# Altium schematic sheet solenoid_drv.SchDoc: Solenoid Control
size A4; Organization: Badgerloop Electrical; Address1: 133 Engineering Research Building; Address2: 1500 Engineering Drive; Address3: Madison, Wi 53706
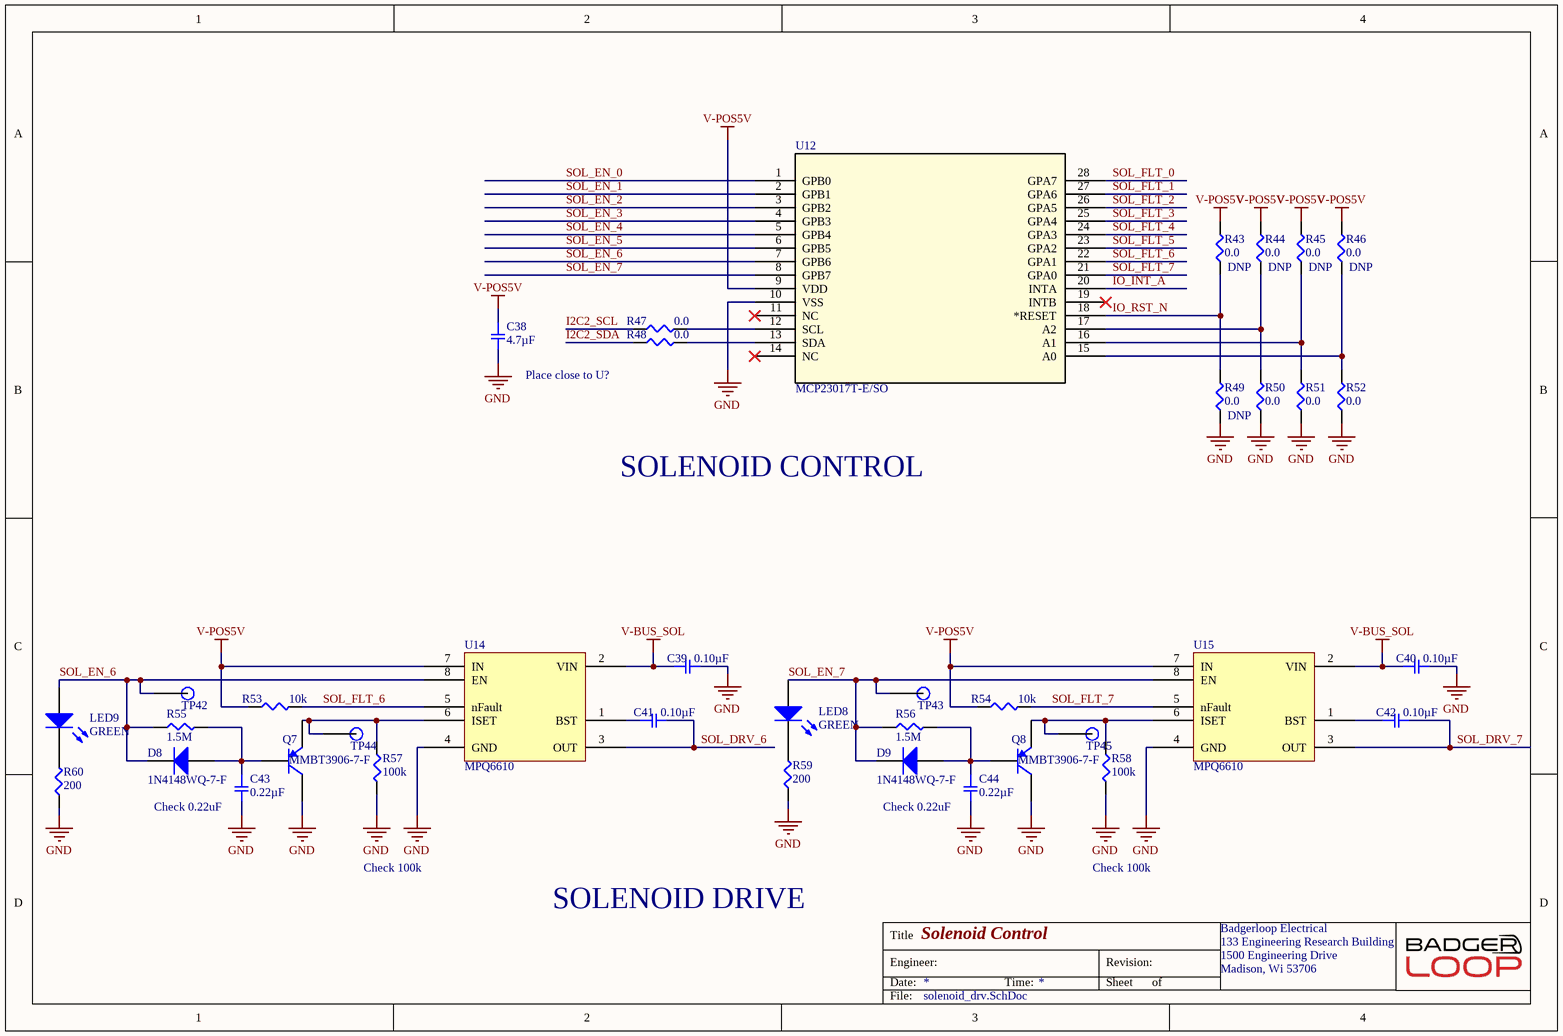
[diagram p0: solenoid_drv.SchDoc]

## Parts
C38  4.7µF  [SMD-0805C]
C39  0.10µF  [SMD-0805C]
C40  0.10µF  [SMD-0805C]
C41  0.10µF  [SMD-0805C]
C42  0.10µF  [SMD-0805C]
C43  0.22µF  [SMD-0805C]
C44  0.22µF  [SMD-0805C]
D8  1N4148WQ-7-F  [INDM3838X18N]
D9  1N4148WQ-7-F  [INDM3838X18N]
LED8  GREEN  [LED 0603 GREEN]
LED9  GREEN  [LED 0603 GREEN]
Q7  MMBT3906-7-F  [SOTFL103P240X110-3N]
Q8  MMBT3906-7-F  [SOTFL103P240X110-3N]
R43  0.0  [SMD-0805-RES]
R44  0.0  [SMD-0805-RES]
R45  0.0  [SMD-0805-RES]
R46  0.0  [SMD-0805-RES]
R47  0.0  [SMD-0805-RES]
R48  0.0  [SMD-0805-RES]
R49  0.0  [SMD-0805-RES]
R50  0.0  [SMD-0805-RES]
R51  0.0  [SMD-0805-RES]
R52  0.0  [SMD-0805-RES]
R53  10k  [SMD-0805-RES]
R54  10k  [SMD-0805-RES]
R55  1.5M  [SMD-0805-RES]
R56  1.5M  [SMD-0805-RES]
R57  100k  [SMD-0805-RES]
R58  100k  [SMD-0805-RES]
R59  200  [SMD-0805-RES]
R60  200  [SMD-0805-RES]
TP42  TP  [Test Point]  (value not drawn)
TP43  TP  [Test Point]  (value not drawn)
TP44  TP  [Test Point]  (value not drawn)
TP45  TP  [Test Point]  (value not drawn)
U12  MCP23017T-E/SO  [SOIC28-W_MC-M]
U14  MPQ6610  [SOP127P600X175-8N]
U15  MPQ6610  [SOP127P600X175-8N]

## Nets
GND: C38.2 C39.2 C40.2 C43.2 C44.2 Q7.3(C) Q8.3(C) R49.1 R50.1 R51.1 R52.1 R57.2 R58.2 R59.1 R60.1 U12.10(VSS) U14.4(GND) U15.4(GND)
V-BUS_SOL: C39.1 C40.1 U14.2(VIN) U15.2(VIN)
V-POS5V: C38.1 R43.2 R44.2 R45.2 R46.2 R53.1 R54.1 U12.9(VDD) U14.7(IN) U15.7(IN)
I2C2_SCL: R47.1
I2C2_SDA: R48.1
IO_INT_A: U12.20(INTA)
IO_RST_N: R43.1 R49.2 U12.18(*RESET)
SOL_DRV_6: C41.2 U14.3(OUT)
SOL_DRV_7: C42.2 U15.3(OUT)
SOL_EN_0: U12.1(GPB0)
SOL_EN_1: U12.2(GPB1)
SOL_EN_2: U12.3(GPB2)
SOL_EN_3: U12.4(GPB3)
SOL_EN_4: U12.5(GPB4)
SOL_EN_5: U12.6(GPB5)
SOL_EN_6: D8.2(K) LED9.1(A) R55.1 TP42.1 U12.7(GPB6) U14.8(EN)
SOL_EN_7: D9.2(K) LED8.1(A) R56.1 TP43.1 U12.8(GPB7) U15.8(EN)
SOL_FLT_0: U12.28(GPA7)
SOL_FLT_1: U12.27(GPA6)
SOL_FLT_2: U12.26(GPA5)
SOL_FLT_3: U12.25(GPA4)
SOL_FLT_4: U12.24(GPA3)
SOL_FLT_5: U12.23(GPA2)
SOL_FLT_6: R53.2 U12.22(GPA1) U14.5(nFault)
SOL_FLT_7: R54.2 U12.21(GPA0) U15.5(nFault)
NetC41_1: C41.1 U14.1(BST)
NetC42_1: C42.1 U15.1(BST)
NetC43_1: C43.1 D8.1(A) Q7.1(B) R55.2
NetC44_1: C44.1 D9.1(A) Q8.1(B) R56.2
NetLED8_2: LED8.2(K) R59.2
NetLED9_2: LED9.2(K) R60.2
NetQ7_2: Q7.2(E) R57.1 TP44.1 U14.6(ISET)
NetQ8_2: Q8.2(E) R58.1 TP45.1 U15.6(ISET)
NetR44_1: R44.1 R50.2 U12.17(A2)
NetR45_1: R45.1 R51.2 U12.16(A1)
NetR46_1: R46.1 R52.2 U12.15(A0)
NetR47_2: R47.2 U12.12(SCL)
NetR48_2: R48.2 U12.13(SDA)

Not connected (* = marked no-connect by the designer): U12 11(NC)* 14(NC)* 19(INTB)*

## Notes on the sheet
- Place close to U?
- SOLENOID CONTROL
- (near C43) Check 0.22uF
- (near C44) Check 0.22uF
- Check 100k
- SOLENOID DRIVE
- Title
- Engineer:
- Date:
- Time:
- Revision:
- Sheet
- of
- File:

## Library data of the parts
C38 = GRM21BR60J475KA11L: CAP CER 4.7UF 6.3V X5R 0805; Manufacturer: Murata Electronics North America; Factory Stock: 0; Unit Price (USD): 0.28; Minimum Quantity: 1; Tolerance: ±10%; Datasheets: http://www.murata.com/~/media/webrenewal/support/library/catalog/products/capacitor/mlcc/c02e.pdf; Image: //media.digikey.com/Renders/Murata%20Renders/0805%20(2012%20Metric)%20.85mm.jpg; Digi-Key Part Number: 490-9749-1-ND; Part Number: GRM21BR60J475KA11L; Quantity Available: 2821; @ qty: 0; Packaging: Cut Tape (CT); Series: GRM; Part Status: Active; Value: 4.7µF; Voltage: 6.3V; Temperature Coefficient: X5R; Operating Temperature: -55°C ~ 85°C; Features: -; Ratings: -; Applications: General Purpose; Mounting Type: Surface Mount, MLCC; Package / Case: 0805 (2012 Metric); Size / Dimension: 0.079" L x 0.049" W (2.00mm x 1.25mm); Height - Seated (Max): -; Thickness (Max): 0.055" (1.40mm); Lead Spacing: -; Lead Style: -
C39-C42 = GRM21B7U1A104JA01L: CAP CER 0.1UF 10V U2J 0805; Manufacturer: Murata Electronics North America; Factory Stock: 0; Unit Price (USD): 0.4; Minimum Quantity: 1; Tolerance: ±5%; Datasheets: http://www.murata.com/~/media/webrenewal/support/library/catalog/products/capacitor/mlcc/c02e.pdf; Image: //media.digikey.com/Renders/Murata%20Renders/0805%20(2012%20Metric)%20.85mm.jpg; Digi-Key Part Number: 490-11592-1-ND; Part Number: GRM21B7U1A104JA01L; Quantity Available: 3390; @ qty: 0; Packaging: Cut Tape (CT); Series: GRM; Part Status: Active; Value: 0.10µF; Voltage: 10V; Temperature Coefficient: U2J; Operating Temperature: -55°C ~ 125°C; Features: -; Ratings: -; Applications: General Purpose; Mounting Type: Surface Mount, MLCC; Package / Case: 0805 (2012 Metric); Size / Dimension: 0.079" L x 0.049" W (2.00mm x 1.25mm); Height - Seated (Max): -; Thickness (Max): 0.053" (1.35mm); Lead Spacing: -; Lead Style: -
C43 C44 = LLA215R71A224MA14L: CAP CER 0.22UF 10V X7R 0805; Manufacturer: Murata Electronics North America; Factory Stock: 0; Unit Price (USD): 0.36; Minimum Quantity: 1; Tolerance: ±20%; Datasheets: http://www.murata.com/~/media/webrenewal/support/library/catalog/products/capacitor/mlcc/c02e.pdf; Image: //media.digikey.com/Renders/Murata%20Renders/0805-LLA.jpg; Digi-Key Part Number: 490-4432-1-ND; Part Number: LLA215R71A224MA14L; Quantity Available: 9914; @ qty: 0; Packaging: Cut Tape (CT); Series: LLA; Part Status: Active; Value: 0.22µF; Voltage: 10V; Temperature Coefficient: X7R; Operating Temperature: -55°C ~ 125°C; Features: Low ESL (Multi-Terminal); Ratings: -; Applications: Bypass, Decoupling; Mounting Type: Surface Mount, MLCC; Package / Case: 0805 (2012 Metric); Size / Dimension: 0.079" L x 0.049" W (2.00mm x 1.25mm); Height - Seated (Max): -; Thickness (Max): 0.022" (0.55mm); Lead Spacing: -; Lead Style: -
D8 D9 = 1N4148WQ-7-F: Diodes - General Purpose, Power, Switching SMT Fast Switching Diode; Manufacturer: Diodes Inc.; Digikey Link: https://www.digikey.com/product-detail/en/diodes-incorporated/1N4148WQ-7-F/1N4148WQ-7-FDITR-ND/8136126; Manufacturer P/N: 1N4148WQ-7-F; Digikey P/N: 1N4148WQ-7-FDITR-ND
LED8 LED9 = LED GREEN 0603: Manufacturer: Lite-On Inc.; Manufacturer P/N: LTST-C190KGKT; Digikey P/N: 160-1435-1-ND; Package / Case: 0603; Color: GREEN
Q7 Q8 = MMBT3906-7-F: Manufacturer: Diodes Zetex; Collector Emitter Voltage (VCEO): 40V; Max Power Dissipation: 300mW; Polarity: PNP; Max Collector Current: 200mA; hFE Min: 100; Number of Elements: 1; Frequency: 250MHz; Emitter Base Voltage (VEBO): 6V; Collector Emitter Saturation Voltage: -400mV; Element Configuration: Single; Continuous Collector Current: -200mA; Voltage Rating (DC): -40V; Supplier 1: Digi-Key; Manufacturer Part Number: MMBT3906-7-F; Stock 1: 687580; Pricing 1: 1=0.12000, 10=0.11400, 100=0.06190, 500=0.03806, 1000=0.02596 (USD); RoHS: Yes; Mount: Surface Mount; Case/Package: SOT-23; Number of Pins: 3; Weight: 0.000282oz; Contact Plating: Tin,Matte; Min Operating Temperature: -55°C; Max Operating Temperature: 150°C; Packaging: Tape and Reel; Package Quantity: 3000; Transition Frequency: 250MHz; Collector Emitter Breakdown Voltage: 40V; Max Breakdown Voltage: 40V; Collector Base Voltage (VCBO): 40V; Power Dissipation: 300mW; Max Frequency: 250MHz; Gain Bandwidth Product: 250MHz; Current Rating: -200mA; Length: 3.05mm; Height: 1mm; Width: 1.4mm; Radiation Hardening: No; REACH SVHC: No SVHC; Lead Free: Lead Free; ComponentLink1URL: https://datasheet.ciiva.com/27052/1540746-27052408.pdf?src-supplier=Jameco; ComponentLink1Description: https://datasheet.ciiva.com/27052/1540746-27052408.pdf?src-supplier=Jameco; ComponentLink2URL: https://datasheet.ciiva.com/15139/getdatasheetpartid-255292-15139821.pdf?src-supplier=Verical; ComponentLink2Description: https://datasheet.ciiva.com/15139/getdatasheetpartid-255292-15139821.pdf?src-supplier=Verical
R43-R52 = ERJ-6GEY0R00V: RES SMD 0.0 OHM JUMPER 1/8W 0805; Manufacturer: Panasonic Electronic Components; Factory Stock: 0; Unit Price (USD): 0.00544; @ qty: 1500; Minimum Quantity: 1; Power (Watts): 0.125W, 1/8W; Part Number: ERJ-6GEY0R00V; Datasheets: http://industrial.panasonic.com/www-cgi/jvcr13pz.cgi?E+PZ+3+AOA0001+ERJ6GEY0R00V+7+WW; Image: //media.digikey.com/Renders/Panasonic%20Renders/ERJ-0805%20Pkg.jpg; Digi-Key Part Number: P0.0ACT-ND; Quantity Available: 1597627; Packaging: Cut Tape (CT); Series: ERJ; Part Status: Active; Value: 0.0; Tolerance: Jumper; Composition: Thick Film; Features: Automotive AEC-Q200; Temperature Coefficient: -; Operating Temperature: -55°C ~ 155°C; Package / Case: 0805 (2012 Metric); Supplier Device Package: 0805; Size / Dimension: 0.079" L x 0.049" W (2.00mm x 1.25mm); Height - Seated (Max): 0.028" (0.70mm); Number of Terminations: 2; Failure Rate: -
  R43-R46 R49: DNP: DNP
R53 R54 = ERJ-P06J103V: RES SMD 10K OHM 5% 1/2W 0805; Manufacturer: Panasonic Electronic Components; Factory Stock: 0; Unit Price (USD): 0.01839; @ qty: 1500; Minimum Quantity: 1; Power (Watts): 0.5W, 1/2W; Temperature Coefficient: ±200ppm/°C; Part Number: ERJ-P06J103V; Datasheets: https://industrial.panasonic.com/cdbs/www-data/pdf/RDA0000/AOA0000C243.pdf; Image: //media.digikey.com/Renders/Panasonic%20Renders/ERJ-0805%20Pkg.jpg; Digi-Key Part Number: P10KADCT-ND; Quantity Available: 413576; Packaging: Cut Tape (CT); Series: ERJ; Part Status: Active; Value: 10k; Tolerance: ±5%; Composition: Thick Film; Features: Automotive AEC-Q200, Pulse Withstanding; Operating Temperature: -55°C ~ 155°C; Package / Case: 0805 (2012 Metric); Supplier Device Package: 0805; Size / Dimension: 0.079" L x 0.049" W (2.00mm x 1.25mm); Height - Seated (Max): 0.028" (0.70mm); Number of Terminations: 2; Failure Rate: -
R55 R56 = ERJ-6GEYJ155V: RES SMD 1.5M OHM 5% 1/8W 0805; Manufacturer: Panasonic Electronic Components; Factory Stock: 0; Unit Price (USD): 0.00496; @ qty: 1500; Minimum Quantity: 1; Power (Watts): 0.125W, 1/8W; Temperature Coefficient: -400/ +150ppm/°C; Part Number: ERJ-6GEYJ155V; Datasheets: http://industrial.panasonic.com/www-cgi/jvcr13pz.cgi?E+PZ+3+AOA0001+ERJ6GEYJ155V+7+WW; Image: //media.digikey.com/Renders/Panasonic%20Renders/ERJ-0805%20Pkg.jpg; Digi-Key Part Number: P1.5MACT-ND; Quantity Available: 51728; Packaging: Cut Tape (CT); Series: ERJ; Part Status: Active; Value: 1.5M; Tolerance: ±5%; Composition: Thick Film; Features: Automotive AEC-Q200; Operating Temperature: -55°C ~ 155°C; Package / Case: 0805 (2012 Metric); Supplier Device Package: 0805; Size / Dimension: 0.079" L x 0.049" W (2.00mm x 1.25mm); Height - Seated (Max): 0.028" (0.70mm); Number of Terminations: 2; Failure Rate: -
R57 R58 = ERJ-P06J104V: RES SMD 100K OHM 5% 1/2W 0805; Manufacturer: Panasonic Electronic Components; Factory Stock: 0; Unit Price (USD): 0.01839; @ qty: 1500; Minimum Quantity: 1; Power (Watts): 0.5W, 1/2W; Temperature Coefficient: ±200ppm/°C; Part Number: ERJ-P06J104V; Datasheets: https://industrial.panasonic.com/cdbs/www-data/pdf/RDA0000/AOA0000C243.pdf; Image: //media.digikey.com/Renders/Panasonic%20Renders/ERJ-0805%20Pkg.jpg; Digi-Key Part Number: P100KADCT-ND; Quantity Available: 82264; Packaging: Cut Tape (CT); Series: ERJ; Part Status: Active; Value: 100k; Tolerance: ±5%; Composition: Thick Film; Features: Automotive AEC-Q200, Pulse Withstanding; Operating Temperature: -55°C ~ 155°C; Package / Case: 0805 (2012 Metric); Supplier Device Package: 0805; Size / Dimension: 0.079" L x 0.049" W (2.00mm x 1.25mm); Height - Seated (Max): 0.028" (0.70mm); Number of Terminations: 2; Failure Rate: -
R59 R60 = ERJ-P06F2000V: RES SMD 200 OHM 1% 1/2W 0805; Manufacturer: Panasonic Electronic Components; Factory Stock: 0; Unit Price (USD): 0.02534; @ qty: 1500; Minimum Quantity: 1; Power (Watts): 0.5W, 1/2W; Temperature Coefficient: ±100ppm/°C; Part Number: ERJ-P06F2000V; Datasheets: https://industrial.panasonic.com/cdbs/www-data/pdf/RDA0000/AOA0000C243.pdf; Image: //media.digikey.com/Renders/Panasonic%20Renders/ERJ-0805%20Pkg.jpg; Digi-Key Part Number: P16064CT-ND; Quantity Available: 14258; Packaging: Cut Tape (CT); Series: ERJ; Part Status: Active; Value: 200; Tolerance: ±1%; Composition: Thick Film; Features: Automotive AEC-Q200, Pulse Withstanding; Operating Temperature: -55°C ~ 155°C; Package / Case: 0805 (2012 Metric); Supplier Device Package: 0805; Size / Dimension: 0.079" L x 0.049" W (2.00mm x 1.25mm); Height - Seated (Max): 0.028" (0.70mm); Number of Terminations: 2; Failure Rate: -
TP42-TP45 = TP: SMD TEST POINT
U12 = MCP23017T-E/SO: IC I/O EXPANDER I2C 16B 28SOIC; Manufacturer: Microchip; Manufacturer P/N: MCP23017T-E/SO; Digikey P/N: MCP23017T-E/SOCT-ND; Digikey Link: https://www.digikey.com/product-detail/en/microchip-technology/MCP23017T-E-SO/MCP23017T-E-SOCT-ND/5358289